# Altium schematic sheet LittleButtons.SchDoc
size Letter; CompanyName: Ploopy Corporation; Organization: Ploopy Corporation; Address1: 137-1140 Burnhamthorpe Road W; Address2: Mississauga; Address3: Ontario; Address4: Canada L5C 0A3; DocumentNumber: 3; Revision: R1.007; SheetNumber: 3; SheetTotal: 9
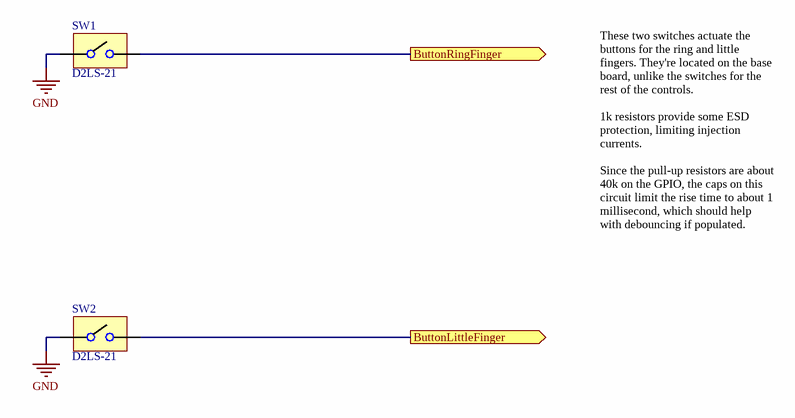
[diagram p0: LittleButtons.SchDoc]

## Parts
SW1  D2LS-21  [D2LS-21]
SW2  D2LS-21  [D2LS-21]

## Ports
ButtonLittleFinger (out), ButtonRingFinger (out)

## Nets
GND: SW1.A SW2.A
ButtonLittleFinger: SW2.B ; port ButtonLittleFinger
ButtonRingFinger: SW1.B ; port ButtonRingFinger

## Notes on the sheet
- These two switches actuate the buttons for the ring and little fingers. They're located on the base board, unlike the switches for the rest of the controls.
  1k resistors provide some ESD protection, limiting injection currents.
  Since the pull-up resistors are about 40k on the GPIO, the caps on this circuit limit the rise time to about 1 millisecond, which should help with debouncing if populated.
- Copyright Ploopy Corporation 2024
- Licensed under the CERN-OHL-S v2
- http://ohwr.org/cernohl
- Title:
- PCB:
- Version:
- Ploopy Corporation
- Mississauga ON L5C 0A3
- 137-1140 Burnhamthorpe Road W
- Date:
- Time:
- Sheet
- of
- Canada

## Library data of the parts
SW1 SW2 = D2LS-21: Compact Surface-mounting Switch for long durability; Supplier 1: Digi-Key; Supplier 2: Mouser; Supplier Part Number 1: Z4378CT-ND; Supplier Part Number 2: 653-D2LS-21